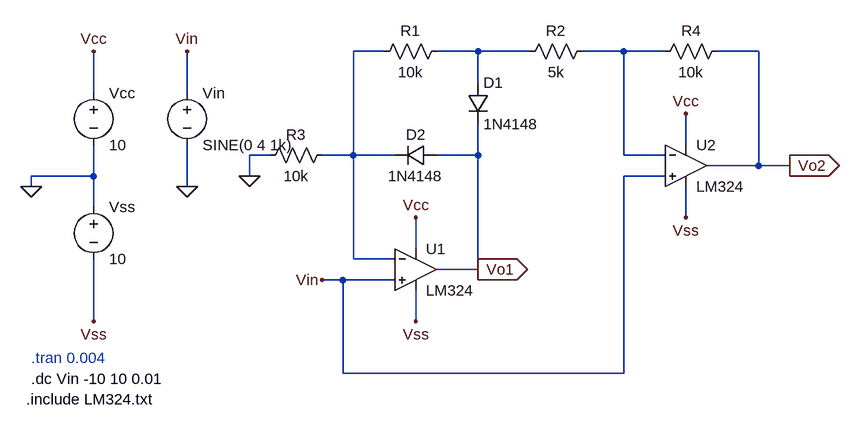
[diagram p0: schematic TP1_3.asc]
TP1_3.asc, the LTspice schematic file:
Version 4
SHEET 1 880 680
WIRE 16 -128 -32 -128
WIRE 160 -128 96 -128
WIRE 240 -128 160 -128
WIRE 384 -128 320 -128
WIRE 448 -128 384 -128
WIRE 592 -128 528 -128
WIRE 160 -80 160 -128
WIRE -432 -64 -432 -128
WIRE -288 -64 -288 -128
WIRE 480 16 480 -32
WIRE -160 32 -192 32
WIRE -32 32 -32 -128
WIRE -32 32 -80 32
WIRE 32 32 -32 32
WIRE 160 32 160 -16
WIRE 160 32 96 32
WIRE 384 32 384 -128
WIRE 448 32 384 32
WIRE 592 48 592 -128
WIRE 592 48 512 48
WIRE 640 48 592 48
WIRE -432 64 -432 16
WIRE -432 64 -528 64
WIRE -192 64 -192 32
WIRE 448 64 384 64
WIRE -528 80 -528 64
WIRE -288 80 -288 16
WIRE -432 112 -432 64
WIRE 480 128 480 80
WIRE 64 176 64 128
WIRE -32 192 -32 32
WIRE 32 192 -32 192
WIRE 160 208 160 32
WIRE 160 208 96 208
WIRE -48 224 -80 224
WIRE 32 224 -48 224
WIRE -432 288 -432 192
WIRE 64 288 64 240
WIRE -48 368 -48 224
WIRE 384 368 384 64
WIRE 384 368 -48 368
FLAG -528 80 0
FLAG -432 -128 Vcc
FLAG -432 288 Vss
FLAG -288 -128 Vin
FLAG -288 80 0
FLAG 64 128 Vcc
FLAG 480 -32 Vcc
FLAG 64 288 Vss
FLAG 480 128 Vss
FLAG -80 224 Vin
FLAG -192 64 0
FLAG 160 208 Vo1
IOPIN 160 208 Out
FLAG 640 48 Vo2
IOPIN 640 48 Out
SYMBOL OpAmps\\opamp2 64 144 R0
SYMATTR InstName U1
SYMATTR Value LM324
SYMBOL OpAmps\\opamp2 480 -16 R0
SYMATTR InstName U2
SYMATTR Value LM324
SYMBOL voltage -432 -80 R0
WINDOW 123 0 0 Left 0
WINDOW 39 0 0 Left 0
SYMATTR InstName Vcc
SYMATTR Value 10
SYMBOL voltage -432 96 R0
WINDOW 123 0 0 Left 0
WINDOW 39 0 0 Left 0
SYMATTR InstName Vss
SYMATTR Value 10
SYMBOL voltage -288 -80 R0
WINDOW 123 0 0 Left 0
WINDOW 39 0 0 Left 0
SYMATTR InstName Vin
SYMATTR Value SINE(0 4 1k)
SYMBOL diode 144 -80 R0
SYMATTR InstName D1
SYMATTR Value 1N4148
SYMBOL diode 96 16 R90
WINDOW 0 0 32 VBottom 2
WINDOW 3 32 32 VTop 2
SYMATTR InstName D2
SYMATTR Value 1N4148
SYMBOL res 0 -112 R270
WINDOW 0 32 56 VTop 2
WINDOW 3 0 56 VBottom 2
SYMATTR InstName R1
SYMATTR Value 10k
SYMATTR SpiceLine tol=1
SYMBOL res 336 -144 R90
WINDOW 0 0 56 VBottom 2
WINDOW 3 32 56 VTop 2
SYMATTR InstName R2
SYMATTR Value 5k
SYMATTR SpiceLine tol=1
SYMBOL res -64 16 R90
WINDOW 0 0 56 VBottom 2
WINDOW 3 32 56 VTop 2
SYMATTR InstName R3
SYMATTR Value 10k
SYMATTR SpiceLine tol=1
SYMBOL res 544 -144 R90
WINDOW 0 0 56 VBottom 2
WINDOW 3 32 56 VTop 2
SYMATTR InstName R4
SYMATTR Value 10k
SYMATTR SpiceLine tol=1
TEXT -536 408 Left 2 !.include LM324.txt
TEXT -528 376 Left 2 !.dc Vin -10 10 0.01
TEXT -528 344 Left 2 ;.tran 0.004

The netlist it stands for:
* TP1_3.asc
XU1 Vin N001 Vcc Vss Vo1 LM324  ; pins In+ In- V+ V- OUT
XU2 Vin N003 Vcc Vss Vo2 LM324  ; pins In+ In- V+ V- OUT
Vcc Vcc 0 10
Vss 0 Vss 10
Vin Vin 0 SINE(0 4 1k)
D1 N002 Vo1 1N4148
D2 Vo1 N001 1N4148
R1 N001 N002 10k tol=1
R2 N003 N002 5k tol=1
R3 N001 0 10k tol=1
R4 Vo2 N003 10k tol=1
.model D D
.lib standard.dio
.include LM324.txt
.dc Vin -10 10 0.01
* .tran 0.004
.backanno
.end